# EAGLE design BaliseEmetteur (EAGLE 5.02)
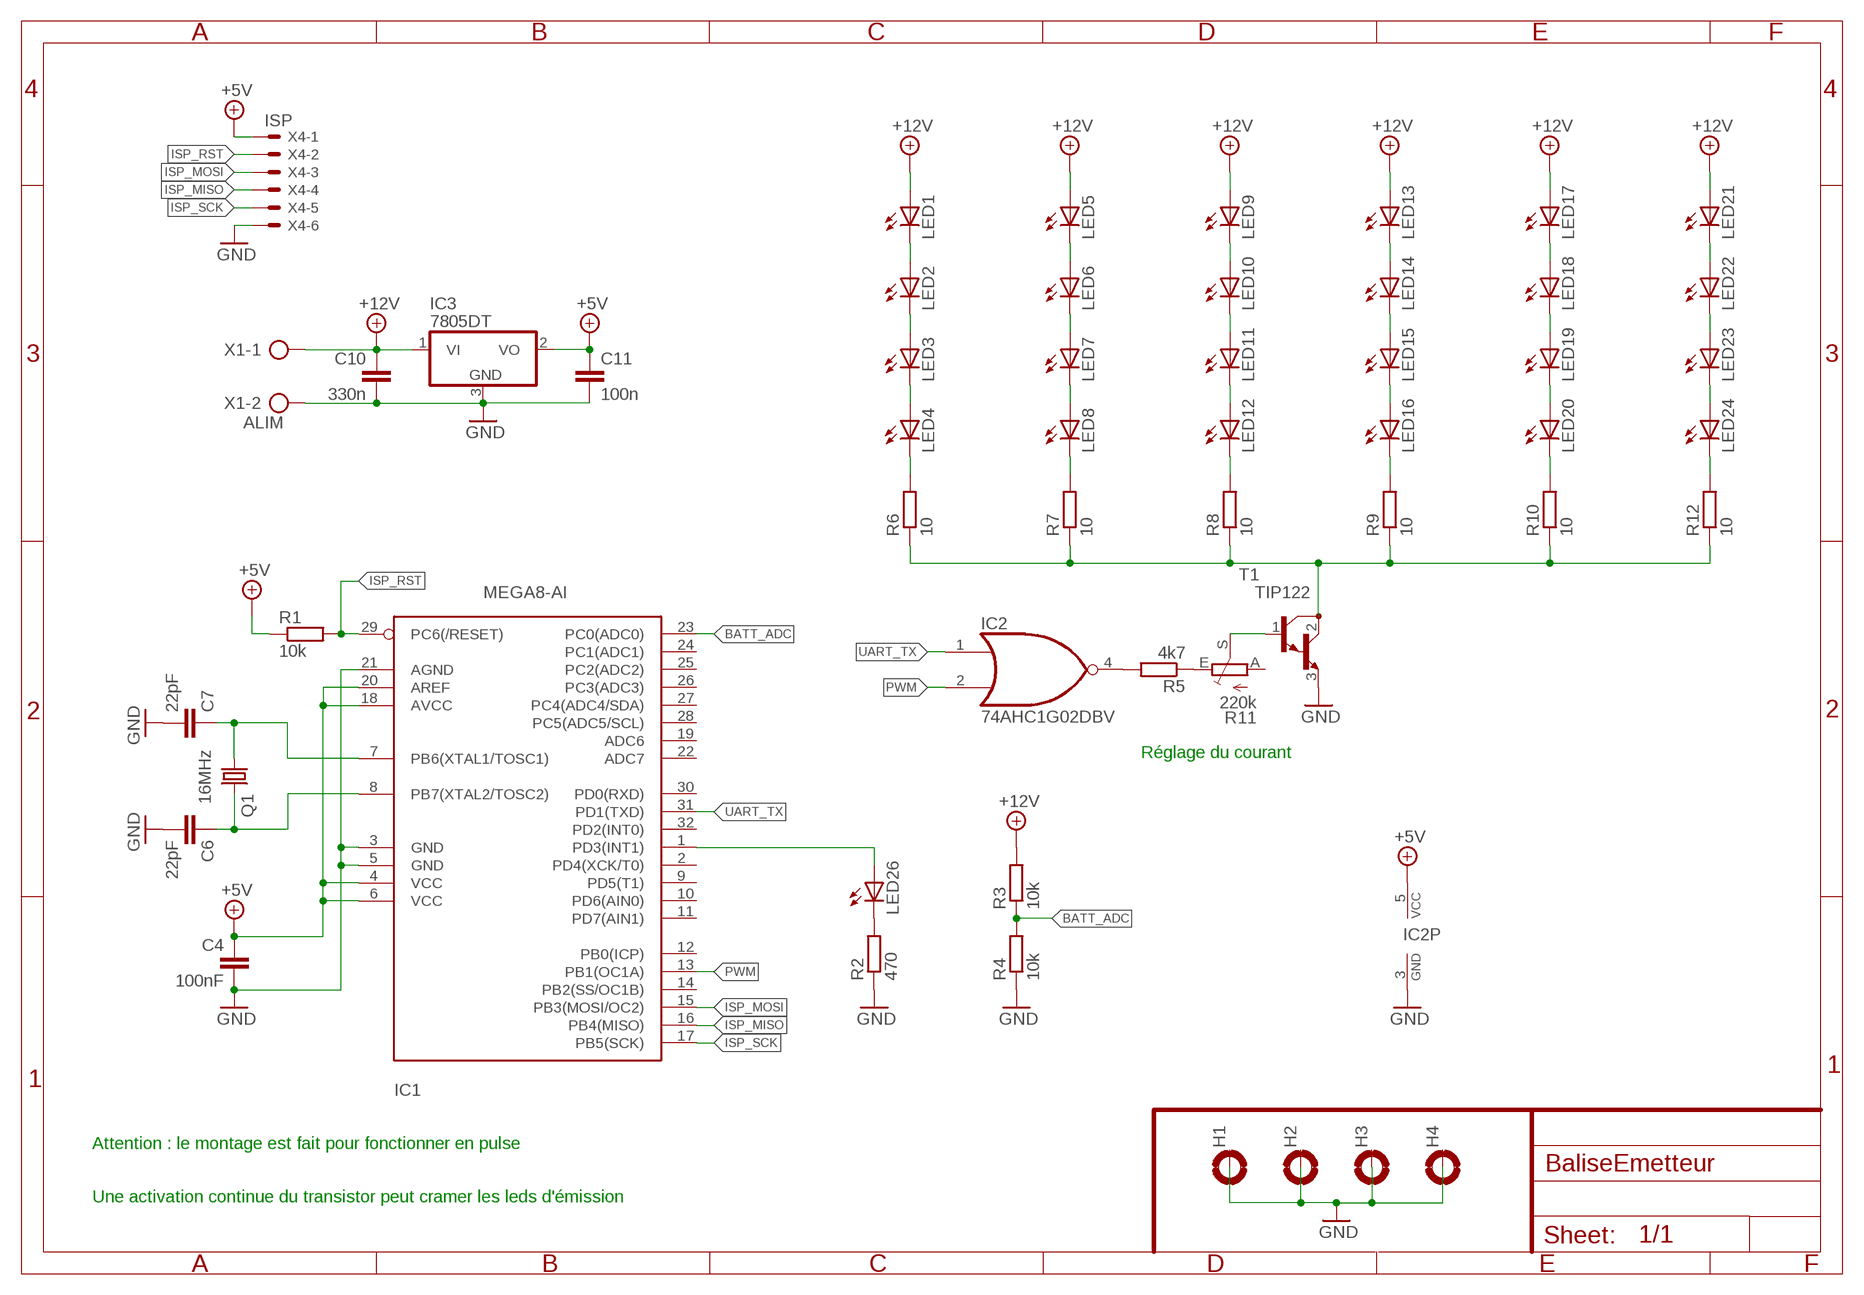
[diagram p0: schematic, sheet 1]

## Parts
C4  100nF  C-EUC0805  [C0805]
C6  22pF  C-EUC0805  [C0805]
C7  22pF  C-EUC0805  [C0805]
C10  330n  C-EUC0805  [C0805]
C11  100n  C-EUC0805  [C0805]
H1  MOUNT-PAD-ROUND3.2  [3,2-PAD]
H2  MOUNT-PAD-ROUND3.2  [3,2-PAD]
H3  MOUNT-PAD-ROUND3.2  [3,2-PAD]
H4  MOUNT-PAD-ROUND3.2  [3,2-PAD]
IC1  MEGA8-AI  [TQFP32-08]
IC2  74AHC1G02DBV  [SOT23-5]
IC3  7805DT  [TO252]
LED1  LEDB155  [Q62902-B155]
LED2  LEDB155  [Q62902-B155]
LED3  LEDB155  [Q62902-B155]
LED4  LEDB155  [Q62902-B155]
LED5  LEDB155  [Q62902-B155]
LED6  LEDB155  [Q62902-B155]
LED7  LEDB155  [Q62902-B155]
LED8  LEDB155  [Q62902-B155]
LED9  LEDB155  [Q62902-B155]
LED10  LEDB155  [Q62902-B155]
LED11  LEDB155  [Q62902-B155]
LED12  LEDB155  [Q62902-B155]
LED13  LEDB155  [Q62902-B155]
LED14  LEDB155  [Q62902-B155]
LED15  LEDB155  [Q62902-B155]
LED16  LEDB155  [Q62902-B155]
LED17  LEDB155  [Q62902-B155]
LED18  LEDB155  [Q62902-B155]
LED19  LEDB155  [Q62902-B155]
LED20  LEDB155  [Q62902-B155]
LED21  LEDB155  [Q62902-B155]
LED22  LEDB155  [Q62902-B155]
LED23  LEDB155  [Q62902-B155]
LED24  LEDB155  [Q62902-B155]
LED26  LED5MM  [LED5MM]
Q1  16MHz  CRYSTALHC49UP  [HC49UP]
R1  10k  R-EU_0207/2V  [0207/2V]
R2  470  R-EU_0207/2V  [0207/2V]
R3  10k  R-EU_0207/2V  [0207/2V]
R4  10k  R-EU_0207/2V  [0207/2V]
R5  4k7  R-EU_0207/10  [0207/10]
R6  10  R-EU_0207/2V  [0207/2V]
R7  10  R-EU_0207/2V  [0207/2V]
R8  10  R-EU_0207/2V  [0207/2V]
R9  10  R-EU_0207/2V  [0207/2V]
R10  10  R-EU_0207/2V  [0207/2V]
R11  220k  TRIM_EU-CA9V  [CA9V]
R12  10  R-EU_0207/2V  [0207/2V]
T1  TIP122  [TO220]
X1  ALIM  AK500/2  [AK500/2]
X4  ISP  53048-06  [53048-06]

## Nets
+5V: C4.1 C11.1 IC1.4(VCC) IC1.6(VCC) IC1.18(AVCC) IC1.20(AREF) IC2.5(VCC) IC3.2(VO) R1.1 X4.1
+12V: C10.1 IC3.1(VI) LED1.A LED5.A LED9.A LED13.A LED17.A LED21.A R3.2 X1.1
BATT_ADC: IC1.23(PC0(ADC0)) R3.1 R4.2
GND: C4.2 C6.2 C7.2 C10.2 C11.2 H1.B3,2(MOUNT) H2.B3,2(MOUNT) H3.B3,2(MOUNT) H4.B3,2(MOUNT) IC1.3(GND) IC1.5(GND) IC1.21(AGND) IC2.3(GND) IC3.3(GND) R2.1 R4.1 T1.3(E) X1.2 X4.6
ISP_MISO: IC1.16(PB4(MISO)) X4.4
ISP_MOSI: IC1.15(PB3(MOSI/OC2)) X4.3
ISP_RST: IC1.29(PC6(/RESET)) R1.2 X4.2
ISP_SCK: IC1.17(PB5(SCK)) X4.5
N$1: LED26.K(C) R2.2
N$2: LED1.K(C) LED2.A
N$3: R5.1 R11.E
N$4: IC1.1(PD3(INT1)) LED26.A
N$5: LED3.K(C) LED4.A
N$6: LED6.K(C) LED7.A
N$7: LED5.K(C) LED6.A
N$8: C7.1 IC1.7(PB6(XTAL1/TOSC1)) Q1.1
N$9: C6.1 IC1.8(PB7(XTAL2/TOSC2)) Q1.2
N$10: LED7.K(C) LED8.A
N$11: LED18.K(C) LED19.A
N$12: LED9.K(C) LED10.A
N$13: LED2.K(C) LED3.A
N$14: LED11.K(C) LED12.A
N$16: LED13.K(C) LED14.A
N$17: R6.1 R7.1 R8.1 R9.1 R10.1 R12.1 T1.2(C)
N$18: LED15.K(C) LED16.A
N$20: LED22.K(C) LED23.A
N$21: LED17.K(C) LED18.A
N$22: LED19.K(C) LED20.A
N$23: LED4.K(C) R6.2
N$24: LED21.K(C) LED22.A
N$25: LED10.K(C) LED11.A
N$26: LED23.K(C) LED24.A
N$27: LED8.K(C) R7.2
N$28: LED14.K(C) LED15.A
N$29: LED12.K(C) R8.2
N$30: LED16.K(C) R9.2
N$31: R11.S T1.1(B)
N$32: LED20.K(C) R10.2
N$33: LED24.K(C) R12.2
N$35: IC2.4(O) R5.2
PWM: IC1.13(PB1(OC1A)) IC2.2(I1)
UART_TX: IC1.31(PD1(TXD)) IC2.1(I0)
Unconnected: IC1.2(PD4(XCK/T0)) IC1.9(PD5(T1)) IC1.10(PD6(AIN0)) IC1.11(PD7(AIN1)) IC1.12(PB0(ICP)) IC1.14(PB2(SS/OC1B)) IC1.19(ADC6) IC1.22(ADC7) IC1.24(PC1(ADC1)) IC1.25(PC2(ADC2)) IC1.26(PC3(ADC3)) IC1.27(PC4(ADC4/SDA)) IC1.28(PC5(ADC5/SCL)) IC1.30(PD0(RXD)) IC1.32(PD2(INT0)) R11.A

## Notes on the sheet
- Réglage du courant
- Attention : le montage est fait pour fonctionner en pulse
- Une activation continue du transistor peut cramer les leds d'émission

## Library data of the parts
C4 C6 C7 C10 C11 = rcl:C-EU: CAPACITOR, European symbol
H1-H4 = holes:MOUNT-PAD-ROUND: MOUNTING PAD, round
IC1 = atmel:MEGA8: MICROCONTROLLER 8 Kbytes FLASH, 1 kbytes SRAM, 512 bytes EEPROM, USART, 6-channel 10 bit ADC, 2-channel 8 bit ADC Pin compatible with Atmega48, ATMega88, ATMega168 Source: avr.lbr
IC2 = 74xx-little-us:74*1G02: 2-input NOR gate
IC3 = linear:78*: Positive VOLTAGE REGULATOR Source: http://cache.national.com/ds/LM/LM78L05.pdf http://www.fairchildsemi.com/ds/LM/LM7805.pdf
LED1-LED24 LED26 = led:LED: LED OSRAM: - CHIPLED LG R971, LG N971, LY N971, LG Q971, LY Q971, LO R971, LY R971 LH N974, LH R974 LS Q976, LO Q976, LY Q976 LO Q996 - Hyper CHIPLED LW Q18S LB Q993, LB Q99A, LB R99A - SideLED LS A670, LO A670, LY A670, LG A670, LP A670 LB A673, LV A673, LT A673, LW A673 LH A674 LY A675 LS A676, LA A676, LO A676, LY A676, LW A676 LS A679, LY A679, LG A679 - Hyper Micro SIDELED® LS Y876, LA Y876, LO Y876, LY Y876 LT Y87S - SmartLED LW L88C, LW L88S LB L89C, LB L89S, LG L890 LS L89K, LO L89K, LY L89K LS L896, LA L896, LO L896, LY L896 - TOPLED LS T670, LO T670, LY T670, LG T670, LP T670 LSG T670, LSP T670, LSY T670, LOP T670, LYG T670 LG T671, LOG T671, LSG T671 LB T673, LV T673, LT T673, LW T673 LH T674 LS T676, LA T676, LO T676, LY T676, LB T676, LH T676, LSB T676, LW T676 LB T67C, LV T67C, LT T67C, LS T67K, LO T67K, LY T67K, LW E67C LS E67B, LA E67B, LO E67B, LY E67B, LB E67C, LV E67C, LT E67C LW T67C LS T679, LY T679, LG T679 LS T770, LO T770, LY T770, LG T770, LP T770 LB T773, LV T773, LT T773, LW T773 LH T774 LS E675, LA E675, LY E675, LS T675 LS T776, LA T776, LO T776, LY T776, LB T776 LHGB T686 LT T68C, LB T68C - Hyper Mini TOPLED® LB M676 - Mini TOPLED Santana® LG M470 LS M47K, LO M47K, LY M47K Source: http://www.osram.convergy.de - LUMILED® LXK2-PW12-R00, LXK2-PW12-S00, LXK2-PW14-U00, LXK2-PW14-V00 LXK2-PM12-R00, LXK2-PM12-S00, LXK2-PM14-U00 LXK2-PE12-Q00, LXK2-PE12-R00, LXK2-PE12-S00, LXK2-PE14-T00, LXK2-PE14-U00 LXK2-PB12-K00, LXK2-PB12-L00, LXK2-PB12-M00, LXK2-PB14-N00, LXK2-PB14-P00, LXK2-PB14-Q00 LXK2-PR12-L00, LXK2-PR12-M00, LXK2-PR14-Q00, LXK2-PR14-R00 LXK2-PD12-Q00, LXK2-PD12-R00, LXK2-PD12-S00 LXK2-PH12-R00, LXK2-PH12-S00 LXK2-PL12-P00, LXK2-PL12-Q00, LXK2-PL12-R00 Source: www.luxeon.com
Q1 = crystal:CRYSTAL: CRYSTAL
R1-R10 R12 = rcl:R-EU_: RESISTOR, European symbol
R11 = pot:TRIM_EU-: POTENTIOMETER
T1 = transistor:TIP122: NPN BIPOLAR DARLINGTON TRANSISTOR
X1 = con-ptr500:AK500/2: CONNECTOR
X4 = con-molex:53?-06: CONNECTOR wire to board 1.25 mm (.049 inch) pitch header

## Board
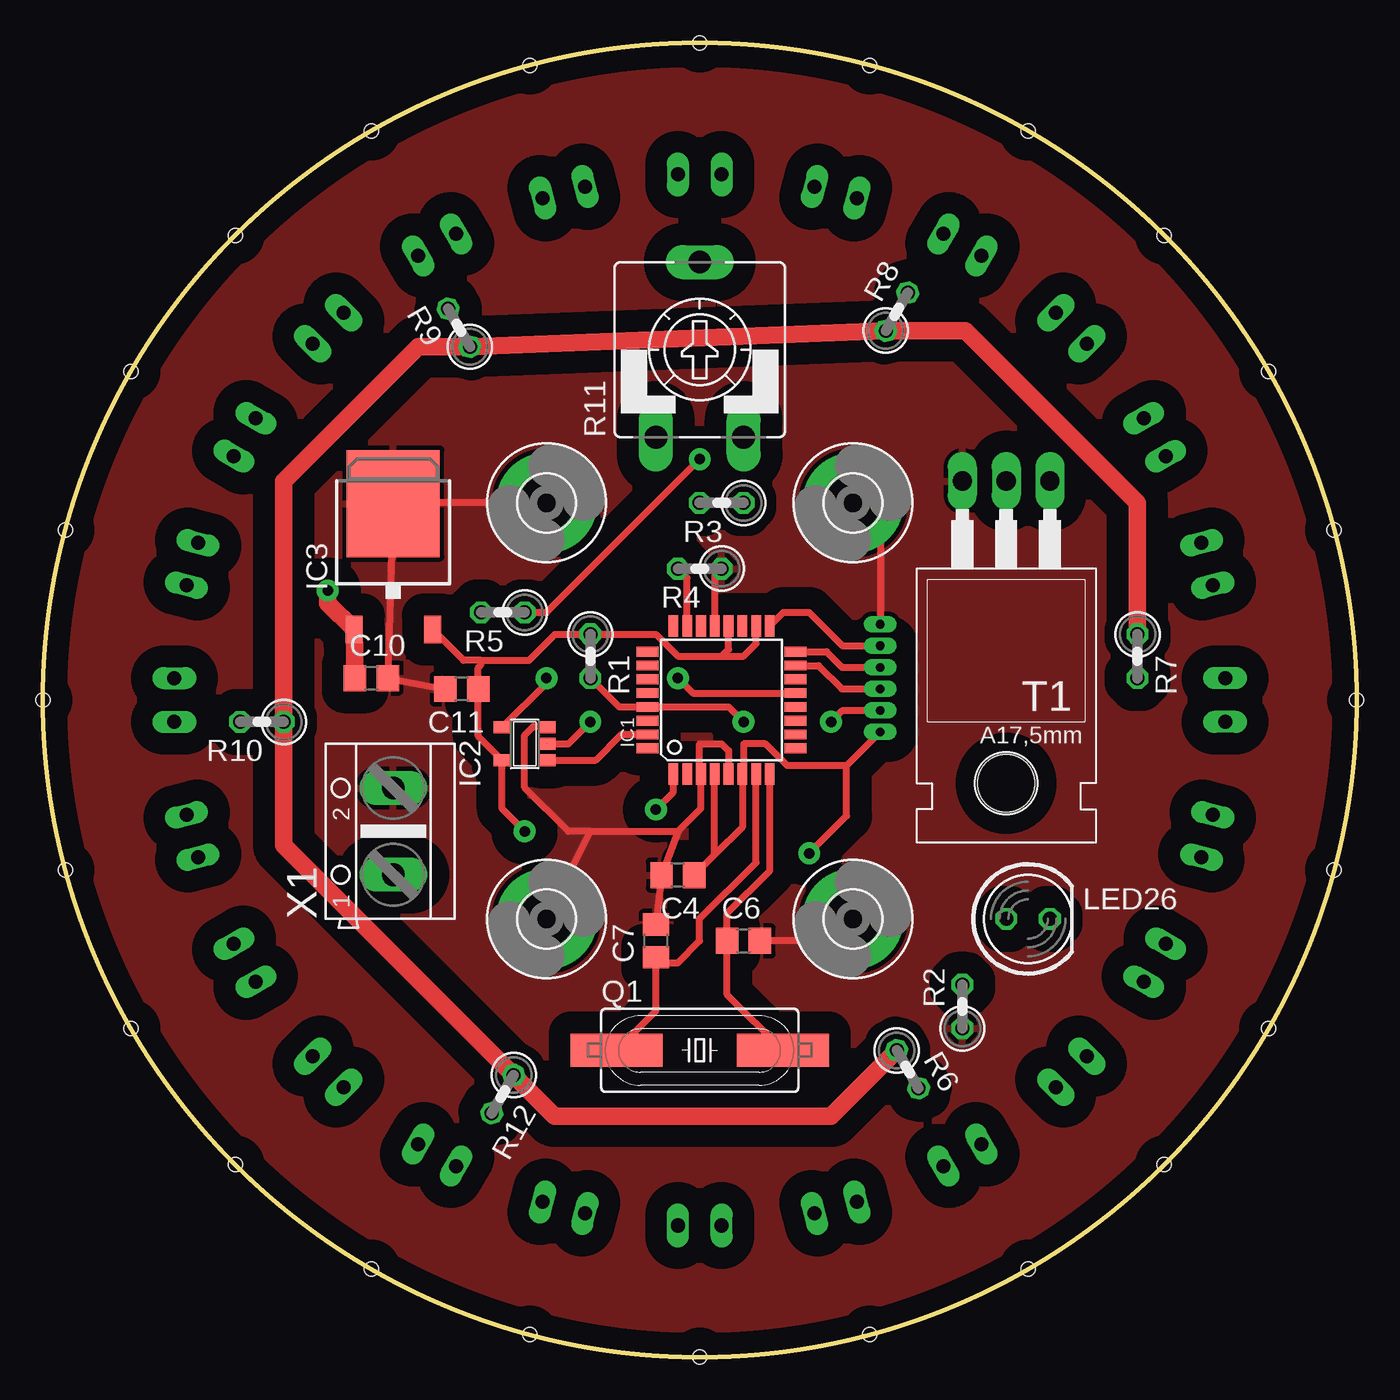
[diagram p1: board, top side]
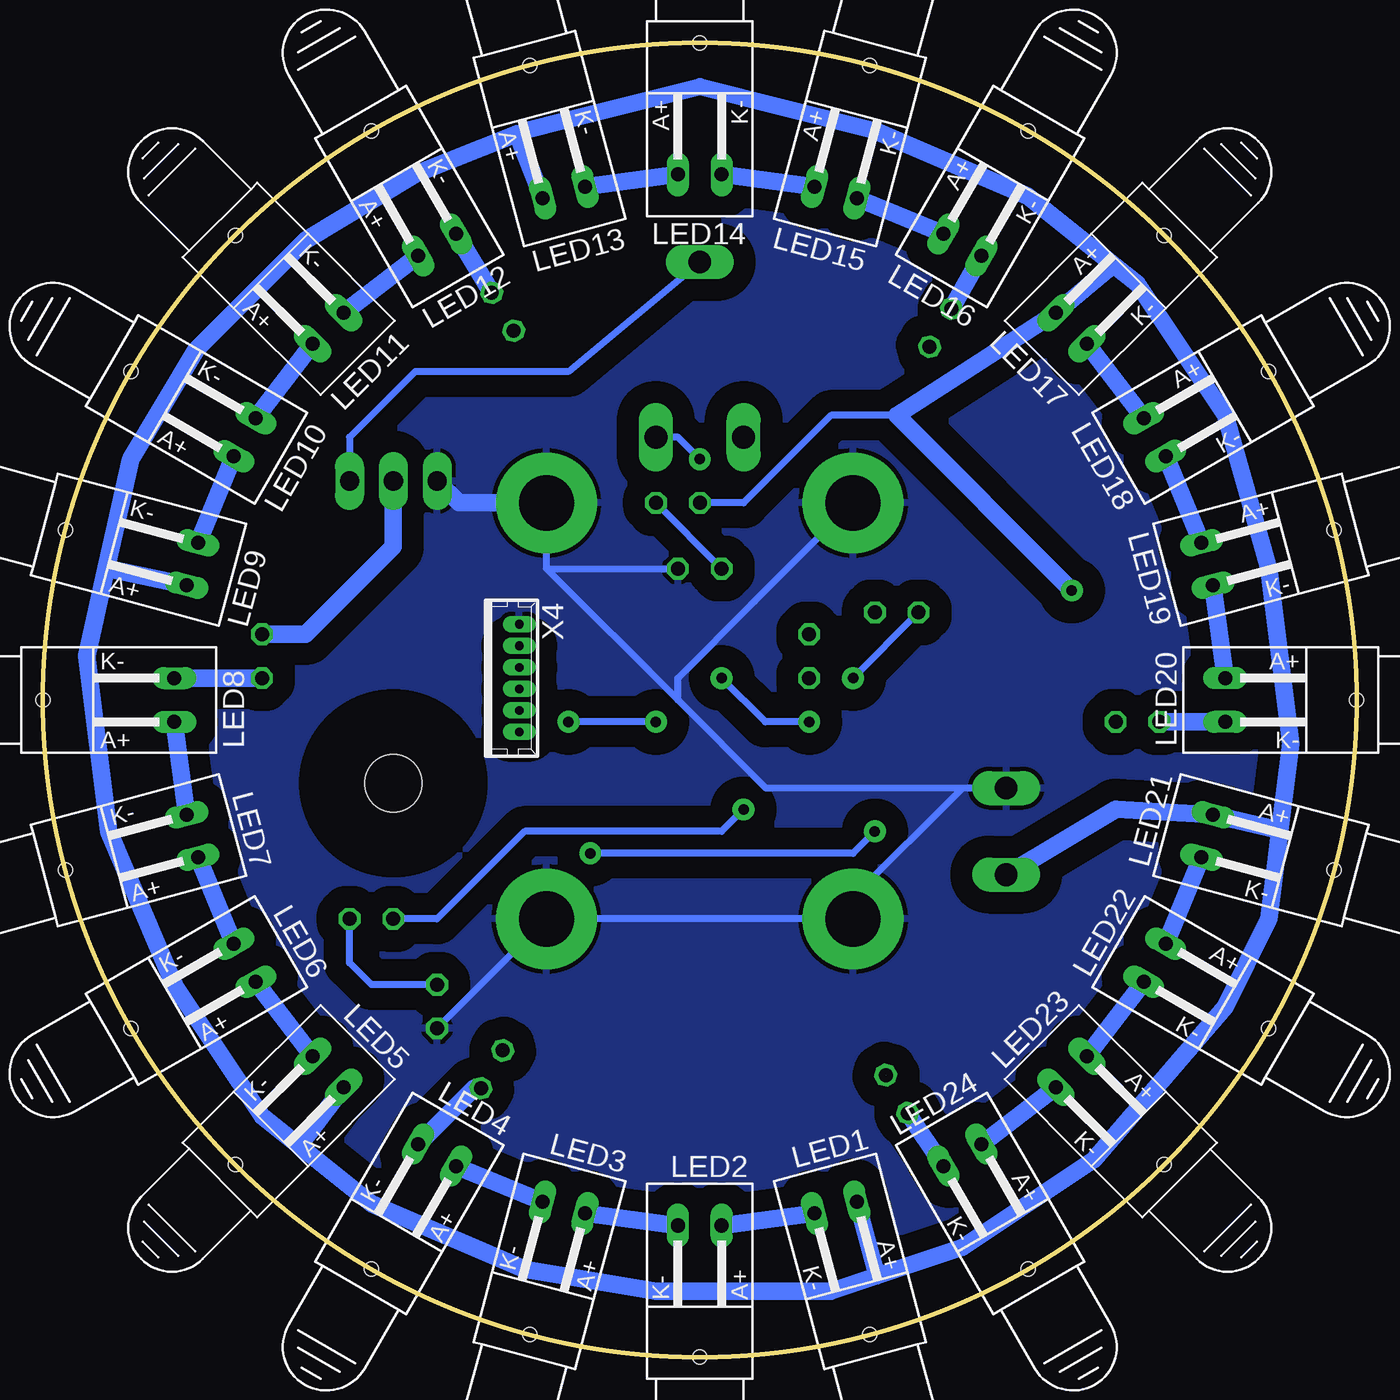
[diagram p2: board, bottom side, seen from below]

Size 76.2 x 76.2 mm. Coordinates in mm from the lower left corner, seen from the top.
Outline: circle at 38.1,38.1 radius 38.1
Copper layers (1*16): Top 0.035mm / dielectric 1.5mm / Bottom 0.035mm
Design rules "The PCB Shop": minimum track width 0.2mm, minimum drill 0.35mm, track to track 0.2mm, track to pad 0.2mm, pad to pad 0.2mm, via to via 0.2mm, smd to smd 0.2mm, copper to edge 30mil, drill to drill 10mil, minimum pad ring 0.225mm, minimum via ring 0.225mm, stop-mask expansion 0mil, vias tented up to drill 0mil, thermal gap 10mil

### Footprints (pad centres in the part's own frame; a part is rotated, then mirrored left to right if it is on the bottom)
C0805 = smd 1.3 x 1.5: 1 -0.95,0; 2 0.95,0
3,2-PAD = drill 3.2 pad 5.842 round: B3,2 0,0
TQFP32-08 = smd 1.27 x 0.559: 1 -4.293,2.8; 2 -4.293,2; 3 -4.293,1.2; 4 -4.293,0.4; 5 -4.293,-0.4; 6 -4.293,-1.2; 7 -4.293,-2; 8 -4.293,-2.8; 17 4.293,-2.8; 18 4.293,-2; 19 4.293,-1.2; 20 4.293,-0.4; 21 4.293,0.4; 22 4.293,1.2; 23 4.293,2; 24 4.293,2.8 | smd 0.559 x 1.27: 9 -2.8,-4.293; 10 -2,-4.293; 11 -1.2,-4.293; 12 -0.4,-4.293; 13 0.4,-4.293; 14 1.2,-4.293; 15 2,-4.293; 16 2.8,-4.293; 25 2.8,4.293; 26 2,4.293; 27 1.2,4.293; 28 0.4,4.293; 29 -0.4,4.293; 30 -1.2,4.293; 31 -2,4.293; 32 -2.8,4.293
SOT23-5 = smd 0.69 x 0.99: 1 -0.95,-1.29; 2 0,-1.29; 3 0.95,-1.29; 4 0.95,1.3; 5 -0.95,1.3
TO252 = smd 1 x 1.6: 1 -2.28,-4.8; 2 2.28,-4.8 | smd 5.4 x 6.2: 3 0,2.5
Q62902-B155 = drill 0.813 long: A 7.62,-1.27; K 7.62,1.27 | hole 0.813: 0,0
LED5MM = drill 0.813 octagon: A -1.27,0; K 1.27,0
HC49UP = smd 5.334 x 1.93: 1 -4.826,0; 2 4.826,0
0207/2V = drill 0.813 octagon: 1 -1.27,0; 2 1.27,0
CA9V = drill 1.321 long: A -2.54,-5.08; E 2.54,-5.08; S 0,5.08
TO220 = drill 1.118 long: 1 -2.54,-6.35; 2 0,-6.35; 3 2.54,-6.35 | hole 3.302: 0,11.176
AK500/2 = drill 1.321 long: 1 -2.515,0; 2 2.515,0
53047-06 = drill 0.5 pad 0.698 long: 1 3.125,0.45; 2 1.875,0.45; 3 0.625,0.45; 4 -0.625,0.45; 5 -1.875,0.45; 6 -3.125,0.45

### Placement (x,y rotation side)
C4  36.83,27.94 180 top
C6  40.64,24.13 0 top
C7  35.56,24.13 90 top
C10  19.05,39.37 0 top
C11  24.3,38.74 180 top
H1  46.99,49.53 0 top
H2  29.21,49.53 0 top
H3  46.99,25.4 0 top
H4  29.21,25.4 0 top
IC1  39.37,38.1 90 top
IC2  27.94,35.56 90 top
IC3  20.32,46.99 0 top
LED1  28.24,1.3 105 bottom
LED2  38.1,0 90 bottom
LED3  47.96,1.3 75 bottom
LED4  57.15,5.1 60 bottom
LED5  65.04,11.16 45 bottom
LED6  71.1,19.05 30 bottom
LED7  74.9,28.24 15 bottom
LED8  76.2,38.1 0 bottom
LED9  74.9,47.96 345 bottom
LED10  71.1,57.15 330 bottom
LED11  65.04,65.04 315 bottom
LED12  57.15,71.1 300 bottom
LED13  47.96,74.9 285 bottom
LED14  38.1,76.2 270 bottom
LED15  28.24,74.9 255 bottom
LED16  19.05,71.1 240 bottom
LED17  11.16,65.04 225 bottom
LED18  5.1,57.15 210 bottom
LED19  1.3,47.96 195 bottom
LED20  0,38.1 180 bottom
LED21  1.3,28.24 165 bottom
LED22  5.1,19.05 150 bottom
LED23  11.16,11.16 135 bottom
LED24  19.05,5.1 120 bottom
LED26  57.15,25.4 0 top
Q1  38.1,17.78 0 top
R1  31.75,40.64 270 top
R2  53.34,20.32 90 top
R3  39.37,49.53 180 top
R4  38.1,45.72 180 top
R5  4k7  [0207/2V]  26.67,43.18 180 top
R6  50.16,16.68 300 top
R7  63.5,40.64 270 top
R8  49.53,60.62 60 top
R9  24.13,59.69 120 top
R10  12.7,36.83 180 top
R11  38.1,58.42 0 top
R12  26.67,15.24 240 top
T1  55.88,44.45 180 top
X1  20.32,30.48 90 top
X4  ISP  [53047-06]  49.02,39.37 270 bottom

### Tracks (layer width: path | path; a pad name or v marks a point on that pad's centre or on a via)
+5V  (via drill 0.61 pad 1.27)
  Top 0.406: IC3.2 24.39,40.4 25.4,40.4 | 39.37,40.64 36.83,40.64 35.56,41.91 R1.1 29.7,41.91 28.18,40.4 25.4,40.4 | 39.37,40.64 39.77,41.04 IC1.20 | IC1.18 41.37,41.37 40.64,40.64 39.37,40.64 | 38.97,29.13 IC1.4 | 38.97,29.13 C4.1 | 38.97,29.13 40.57,30.73 IC1.6 40.64,33.88 40.64,35.56 41.91,35.56 43.18,34.29 46.62,34.29 | 27.91,30.51 v27.94,30.48 26.64,31.78 IC2.5 25.25,36 C11.1 25.25,39.98 25.4,40.13 25.4,40.4 | 46.62,34.29 X4.1 | v44.45,29.21 46.62,31.38 46.62,34.29
  Bottom 0.406: v27.94,30.48 29.21,29.21 v44.45,29.21
+12V  (via drill 0.61 pad 1.27)
  Top 1.016: C10.1 IC3.1 16.51,43.72 v16.51,44.45
  Bottom 0.406: 48.26,71.12 48.7,70.94 | R3.2 35.56,49.53 30.48,54.61 26.67,54.61
  Bottom 1.016: 4.43,30.56 4.77,27.9 5.08,25.4 7.62,20.32 15.24,11.43 22.86,6.35 27.81,4.7 | 4.43,30.56 3.81,35.56 5.08,45.72 7.62,54.61 12.7,62.23 14.09,63.34 | 14.09,63.34 19.05,67.31 27.94,71.12 38.1,73.66 45.87,71.72 48.26,71.12 | 72.52,45.75 73.66,40.64 72.39,30.48 68.58,21.59 63.5,13.97 61.33,12.24 | 72.52,45.75 71.99,48.17 71.12,52.07 67.31,58.42 60.96,64.77 54.61,68.58 48.7,70.94 LED13.A | 61.33,12.24 57.15,8.89 48.26,5.08 40.64,3.81 30.48,3.81 27.81,4.7 | 4.43,30.56 LED21.A 13.97,31.75 X1.1 | 14.09,63.34 LED17.A 26.67,54.61 v16.51,44.45 | 72.52,45.75 LED9.A | 61.33,12.24 LED5.A | 27.81,4.7 LED1.A | v16.51,44.45
BATT_ADC
  Top 0.406: R4.2 37.37,45.18 IC1.23
  Bottom 0.406: R4.2 R3.1
GND
  Top 0.406: H2.B3,2 20.36,49.53 IC3.3 C10.2 C11.2 | 36.83,30.48 38.17,31.82 IC1.3 38.1,33.88 38.1,35.56 39.37,35.56 39.77,35.16 IC1.5 | 31.75,30.48 36.83,30.48 | 36.83,30.48 C4.2 C7.2 | H4.B3,2 31.75,30.48 | IC1.21 38.97,45.32 R4.1 | 29.21,36.51 IC2.3 29.16,36.58 28.45,36.58 27.94,36.07 27.94,33.02 30.48,30.48 31.75,30.48 | C6.2 45.72,24.13 H3.B3,2 | X4.6 48.57,47.95 H1.B3,2
  Bottom 0.406: X1.2 22.86,32.99 | 22.86,32.99 25.4,32.99 34.26,32.99 39.37,38.1 | 39.37,38.1 39.37,39.37 34.92,43.81 H2.B3,2 | 46.99,45.72 H1.B3,2 | 39.37,38.1 46.99,45.72 | R4.1 46.99,45.72 | R2.1 H3.B3,2 H4.B3,2 29.21,26.64 22.86,32.99 | R2.1
  Bottom 1.016: T1.3 52.07,49.53 H1.B3,2
  pour Top (isolate 1.27): 86.36,85.09 -8.89,85.09 -8.89,-12.7 86.36,-12.7
  pour Bottom (isolate 1.27): -8.89,85.09 86.36,85.09 86.36,-12.7 -8.89,-12.7
ISP_MISO
  Top 0.406: IC1.16 45.46,40.9 46.37,39.99 X4.4
ISP_MOSI
  Top 0.406: IC1.15 44.99,40.1 46.34,38.74 X4.3
ISP_RST  (via drill 0.61 pad 1.27)
  Top 0.406: R1.2 33.42,37.7 IC1.29 39.77,37.7 v40.64,36.83 | v45.72,36.83 46.38,37.49 X4.2
  Bottom 0.406: v40.64,36.83 v45.72,36.83
ISP_SCK
  Top 0.406: IC1.17 42.96,43.18 44.45,43.18 46.38,41.24 X4.5
N$1
  Bottom 0.406: R2.2 57.15,21.59 58.42,22.86 LED26.K | LED26.K
N$2
  Bottom 1.016: LED1.K LED2.A
N$3  (via drill 0.61 pad 1.27)
  Top 0.406: R5.1 29.21,43.18 v38.1,52.07
  Bottom 0.406: v38.1,52.07 39.37,53.34 R11.E
N$4  (via drill 0.61 pad 1.27)
  Top 0.406: IC1.1 36.57,32.76 v35.56,31.75
  Bottom 0.406: v35.56,31.75 36.83,30.48 48.26,30.48 53.34,25.4 LED26.A | LED26.A
N$5
  Bottom 1.016: LED3.K LED4.A
N$6
  Bottom 1.016: LED6.K LED7.A
N$7
  Bottom 1.016: LED5.K LED6.A
N$8
  Top 0.406: Q1.1 35.56,20.07 C7.1 35.88,22.86 36.83,22.86 38.1,24.13 38.1,25.4 41.37,28.67 IC1.7
N$9
  Top 0.406: Q1.2 39.69,21.02 C6.1 39.69,25.72 42.17,28.2 IC1.8
N$10
  Bottom 1.016: LED7.K LED8.A
N$11
  Bottom 1.016: LED19.A LED18.K
N$12
  Bottom 1.016: LED9.K LED10.A
N$13
  Bottom 1.016: LED2.K LED3.A
N$14
  Bottom 1.016: LED12.A LED11.K
N$16
  Bottom 1.016: LED14.A LED13.K
N$17  (2 unrouted)
  Top 0.406: R6.1
  Top 1.016: R6.1 45.72,13.97 29.67,13.97 R12.1 13.97,29.68 R10.1 13.97,50.8 21.76,58.59 R9.1 R8.1 53.51,59.52 63.5,49.53 R7.1
  Bottom 1.016: T1.2 55.88,46.99 60.96,41.91 R7.1
N$18
  Bottom 1.016: LED16.A LED15.K
N$20
  Bottom 1.016: LED23.A LED22.K
N$21
  Bottom 1.016: LED18.A LED17.K
N$22
  Bottom 1.016: LED20.A LED19.K
N$23
  Bottom 0.406: R6.2 51.2,15.58
  Bottom 1.016: 51.2,15.58 LED4.K
N$24
  Bottom 1.016: LED22.A LED21.K
N$25
  Bottom 1.016: LED10.K LED11.A
N$26
  Bottom 1.016: LED24.A LED23.K
N$27
  Bottom 1.016: R7.2 LED8.K
N$28
  Bottom 1.016: LED15.A LED14.K
N$29  (1 unrouted)
  Bottom 1.016: R8.2 LED12.K
N$30  (1 unrouted)
  Bottom 1.016: R9.2 LED16.K
N$31
  Bottom 0.406: R11.S 45.72,57.15 54.61,57.15 58.42,53.34 T1.1
N$32
  Bottom 1.016: LED20.K R10.2
N$33
  Bottom 1.016: LED24.K R12.2
N$35  (via drill 0.61 pad 1.27)
  Top 0.406: v29.21,39.37 29.21,39.08 IC2.4
  Bottom 0.406: v29.21,39.37 R5.2 | v29.21,39.37
PWM  (via drill 0.61 pad 1.27)
  Top 0.406: IC2.2 30.48,35.56 v31.75,36.83 | v36.83,39.37 37.7,38.5 IC1.13
  Bottom 0.406: v31.75,36.83 34.29,36.83 v36.83,39.37
UART_TX
  Top 0.406: IC2.1 32.07,34.61 33.56,36.1 IC1.31